# Altium schematic sheet DigitalCameraStitcher.SchDoc: CameraCube
size A; Revision: 1
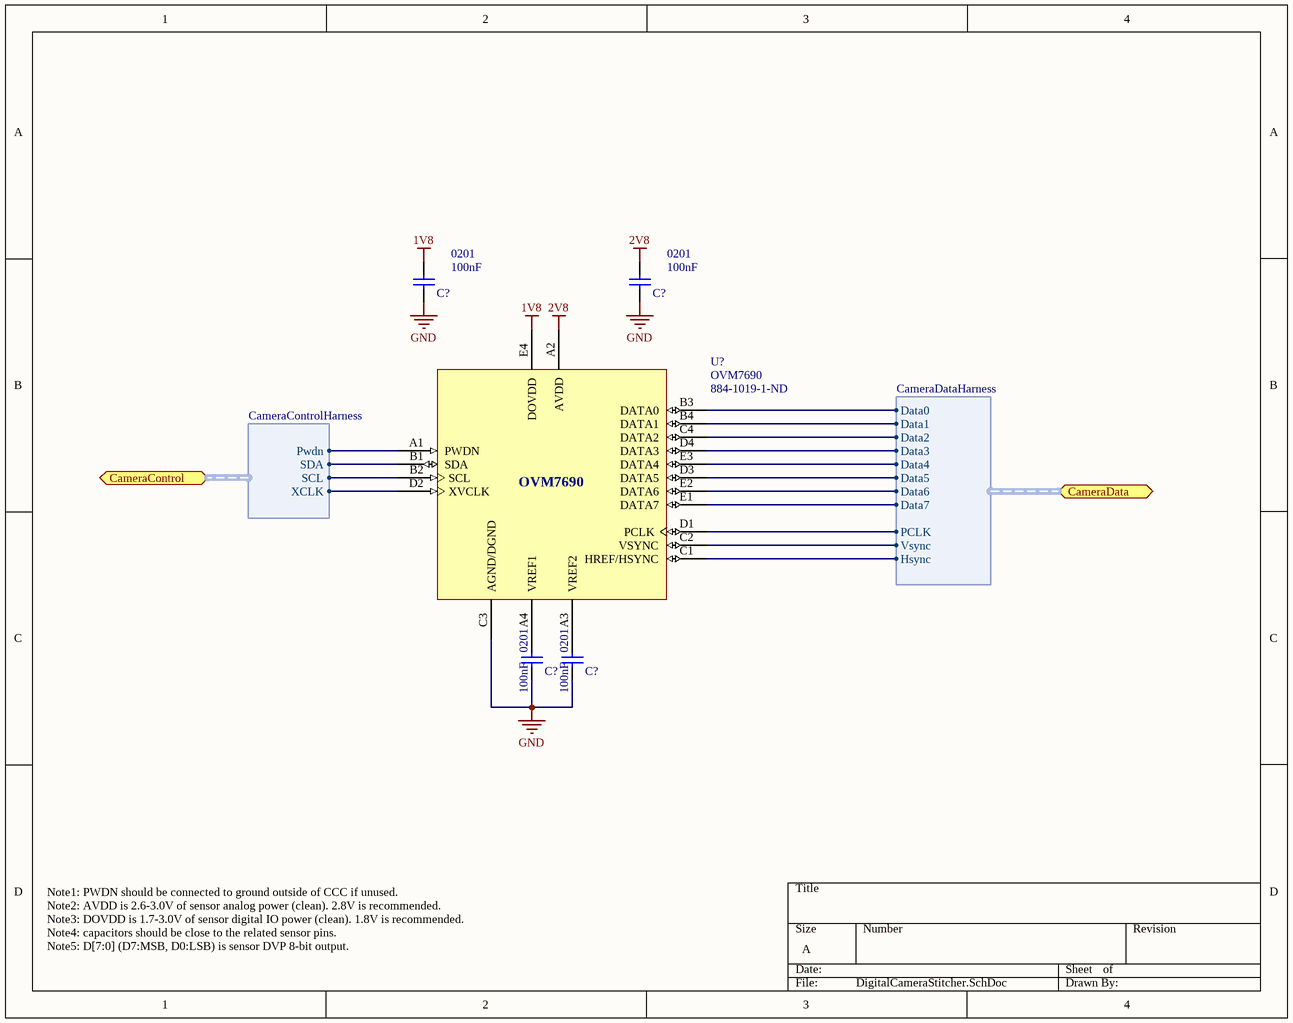
[diagram p0: DigitalCameraStitcher.SchDoc]

## Parts
(Parts that share a designator on the sheet are numbered #1, #2 ... from top to bottom, then left to right.)
C?#1  value 100nF  Case-EIA: 0201  [CAPC0201(0603)33_M]  (hidden comment: CAP 100nF 4V 0201(0603))
C?#2  value 100nF  Case-EIA: 0201  [CAPC0201(0603)33_M]  (hidden comment: CAP 100nF 4V 0201(0603))
C?#3  value 100nF  Case-EIA: 0201  [CAPC0201(0603)33_M]  (hidden comment: CAP 100nF 4V 0201(0603))
C?#4  value 100nF  Case-EIA: 0201  [CAPC0201(0603)33_M]  (hidden comment: CAP 100nF 4V 0201(0603))
U?  OVM7690  Supplier Part Number 1: 884-1019-1-ND  [OVM7690]

## Ports
CameraControl (harness CameraControlHarness), CameraData (harness CameraDataHarness)

## Harnesses
CameraDataHarness: Data0, Data1, Data2, Data3, Data4, Data5, Data6, Data7, PCLK, Vsync, Hsync
CameraControlHarness: SDA, SCL, XCLK, Pwdn

## Nets
1V8: C?#1.1 U?.E4(DOVDD)
2V8: C?#2.1 U?.A2(AVDD)
GND: C?#1.2 C?#2.2 C?#3.2 C?#4.2 U?.C3(AGND/DGND)
NetC?#3_1: C?#3.1 U?.A4(VREF1)
NetC?#4_1: C?#4.1 U?.A3(VREF2)
NetU?_A1: U?.A1(PWDN) ; port CameraControl.Pwdn
NetU?_B1: U?.B1(SDA) ; port CameraControl.SDA
NetU?_B2: U?.B2(SCL) ; port CameraControl.SCL
NetU?_B3: U?.B3(DATA0) ; port CameraData.Data0
NetU?_B4: U?.B4(DATA1) ; port CameraData.Data1
NetU?_C1: U?.C1(HREF/HSYNC) ; port CameraData.Hsync
NetU?_C2: U?.C2(VSYNC) ; port CameraData.Vsync
NetU?_C4: U?.C4(DATA2) ; port CameraData.Data2
NetU?_D1: U?.D1(PCLK) ; port CameraData.PCLK
NetU?_D2: U?.D2(XVCLK) ; port CameraControl.XCLK
NetU?_D3: U?.D3(DATA5) ; port CameraData.Data5
NetU?_D4: U?.D4(DATA3) ; port CameraData.Data3
NetU?_E1: U?.E1(DATA7) ; port CameraData.Data7
NetU?_E2: U?.E2(DATA6) ; port CameraData.Data6
NetU?_E3: U?.E3(DATA4) ; port CameraData.Data4

## Notes on the sheet
- Note1: PWDN should be connected to ground outside of CCC if unused.
  Note2: AVDD is 2.6-3.0V of sensor analog power (clean). 2.8V is recommended.
  Note3: DOVDD is 1.7-3.0V of sensor digital IO power (clean). 1.8V is recommended.
  Note4: capacitors should be close to the related sensor pins.
  Note5: D[7:0] (D7:MSB, D0:LSB) is sensor DVP 8-bit output.

## Library data of the parts
C?#1-C?#4 = CMP-1033-00657-1: CAP 100nF 4V ±10% 0201 (0603 Metric) Thickness 0.33mm SMD; Case-Metric: 0603; Technology: SMT; Max Thickness: 0.33 mm; Tolerance: ±10%; Rated Voltage: 4 V
U? = OVM7690: Supplier 1: Digi-Key